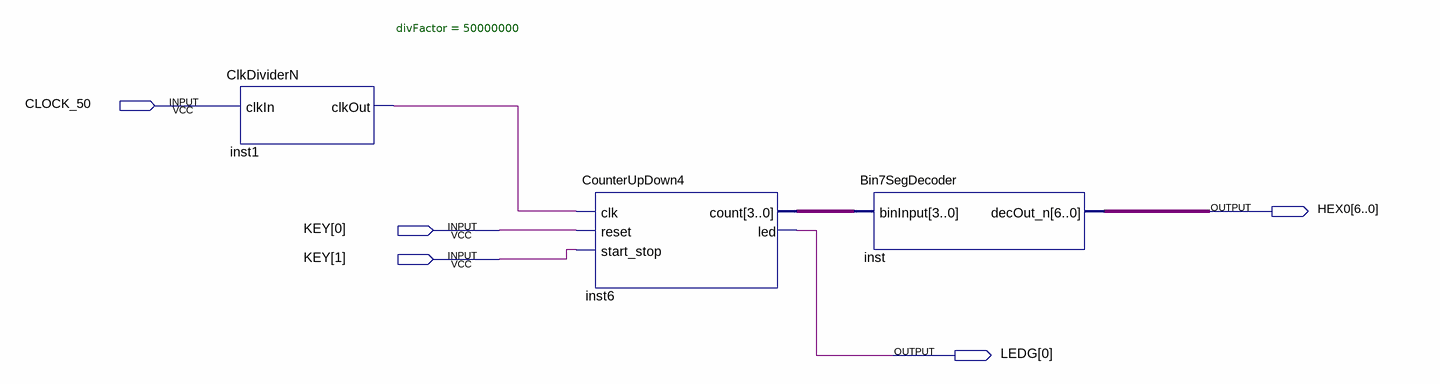
[diagram p0: schematic sheet]
// Quartus schematic mini_projeto.bdf as structural Verilog: 3 symbols, 5 pins
module mini_projeto (
  input  CLOCK_50,
  input  [1:0] KEY,
  output [6:0] HEX0,
  output [0:0] LEDG
);

  wire inst1_clkout;
  wire [3:0] inst6_count;

  ClkDividerN #(.divFactor(50000000)) inst1 (.clkIn(CLOCK_50), .clkOut(inst1_clkout));
  CounterUpDown4 inst6 (.clk(inst1_clkout), .reset(KEY[0]), .start_stop(KEY[1]), .count(inst6_count), .led(LEDG[0]));
  Bin7SegDecoder inst (.binInput(inst6_count), .decOut_n(HEX0));
endmodule
